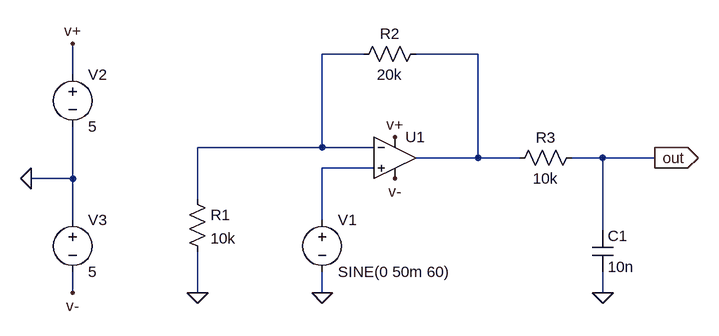
[diagram p0: schematic Analog-Signal-Conditioning-PCB.asc]
Analog-Signal-Conditioning-PCB.asc, the LTspice schematic file:
Version 4.1
SHEET 1 1116 680
WIRE 528 -256 464 -256
WIRE 704 -256 608 -256
WIRE 80 -224 80 -272
WIRE 464 -112 464 -256
WIRE 464 -112 272 -112
WIRE 544 -112 464 -112
WIRE 704 -96 704 -256
WIRE 704 -96 608 -96
WIRE 768 -96 704 -96
WIRE 896 -96 848 -96
WIRE 976 -96 896 -96
WIRE 544 -80 464 -80
WIRE 80 -64 80 -144
WIRE 80 -64 16 -64
WIRE 272 -32 272 -112
WIRE 80 0 80 -64
WIRE 464 0 464 -80
WIRE 896 16 896 -96
WIRE 80 112 80 80
WIRE 272 112 272 48
WIRE 464 112 464 80
WIRE 896 112 896 80
FLAG 576 -128 v+
FLAG 576 -64 v-
FLAG 464 112 0
FLAG 272 112 0
FLAG 16 -64 0
FLAG 80 -272 v+
FLAG 80 112 v-
FLAG 896 112 0
FLAG 976 -96 out
IOPIN 976 -96 Out
SYMBOL voltage 464 -16 R0
WINDOW 123 24 124 Left 2
WINDOW 39 0 0 Left 0
SYMATTR InstName V1
SYMATTR Value SINE(0 50m 60)
SYMBOL res 624 -272 R90
WINDOW 0 0 56 VBottom 2
WINDOW 3 32 56 VTop 2
SYMATTR InstName R2
SYMATTR Value 20k
SYMBOL res 256 -48 R0
SYMATTR InstName R1
SYMATTR Value 10k
SYMBOL voltage 80 -240 R0
SYMATTR InstName V2
SYMATTR Value 5
SYMBOL voltage 80 -16 R0
SYMATTR InstName V3
SYMATTR Value 5
SYMBOL OpAmps\\UniversalOpAmp2 576 -96 R0
SYMATTR InstName U1
SYMBOL res 864 -112 R90
WINDOW 0 0 56 VBottom 2
WINDOW 3 32 56 VTop 2
SYMATTR InstName R3
SYMATTR Value 10k
SYMBOL cap 880 16 R0
SYMATTR InstName C1
SYMATTR Value 10n

The netlist it stands for:
* Analog-Signal-Conditioning-PCB.asc
V1 N003 0 SINE(0 50m 60)
R2 N002 N001 20k
R1 N001 0 10k
V2 v+ 0 5
V3 0 v- 5
X§U1 N003 N001 v+ v- N002 level2 Avol=1Meg GBW=10Meg Slew=10Meg Ilimit=25m Rail=0 Vos=0 En=0 Enk=0 In=0 Ink=0 Rin=500Meg  ; pins In+ In- V+ V- OUT
R3 out N002 10k
C1 out 0 10n
.lib UniversalOpAmp2.lib
.backanno
.end